# Altium schematic sheet openmv4.SchDoc
size A3; DrawnBy: 小白菜
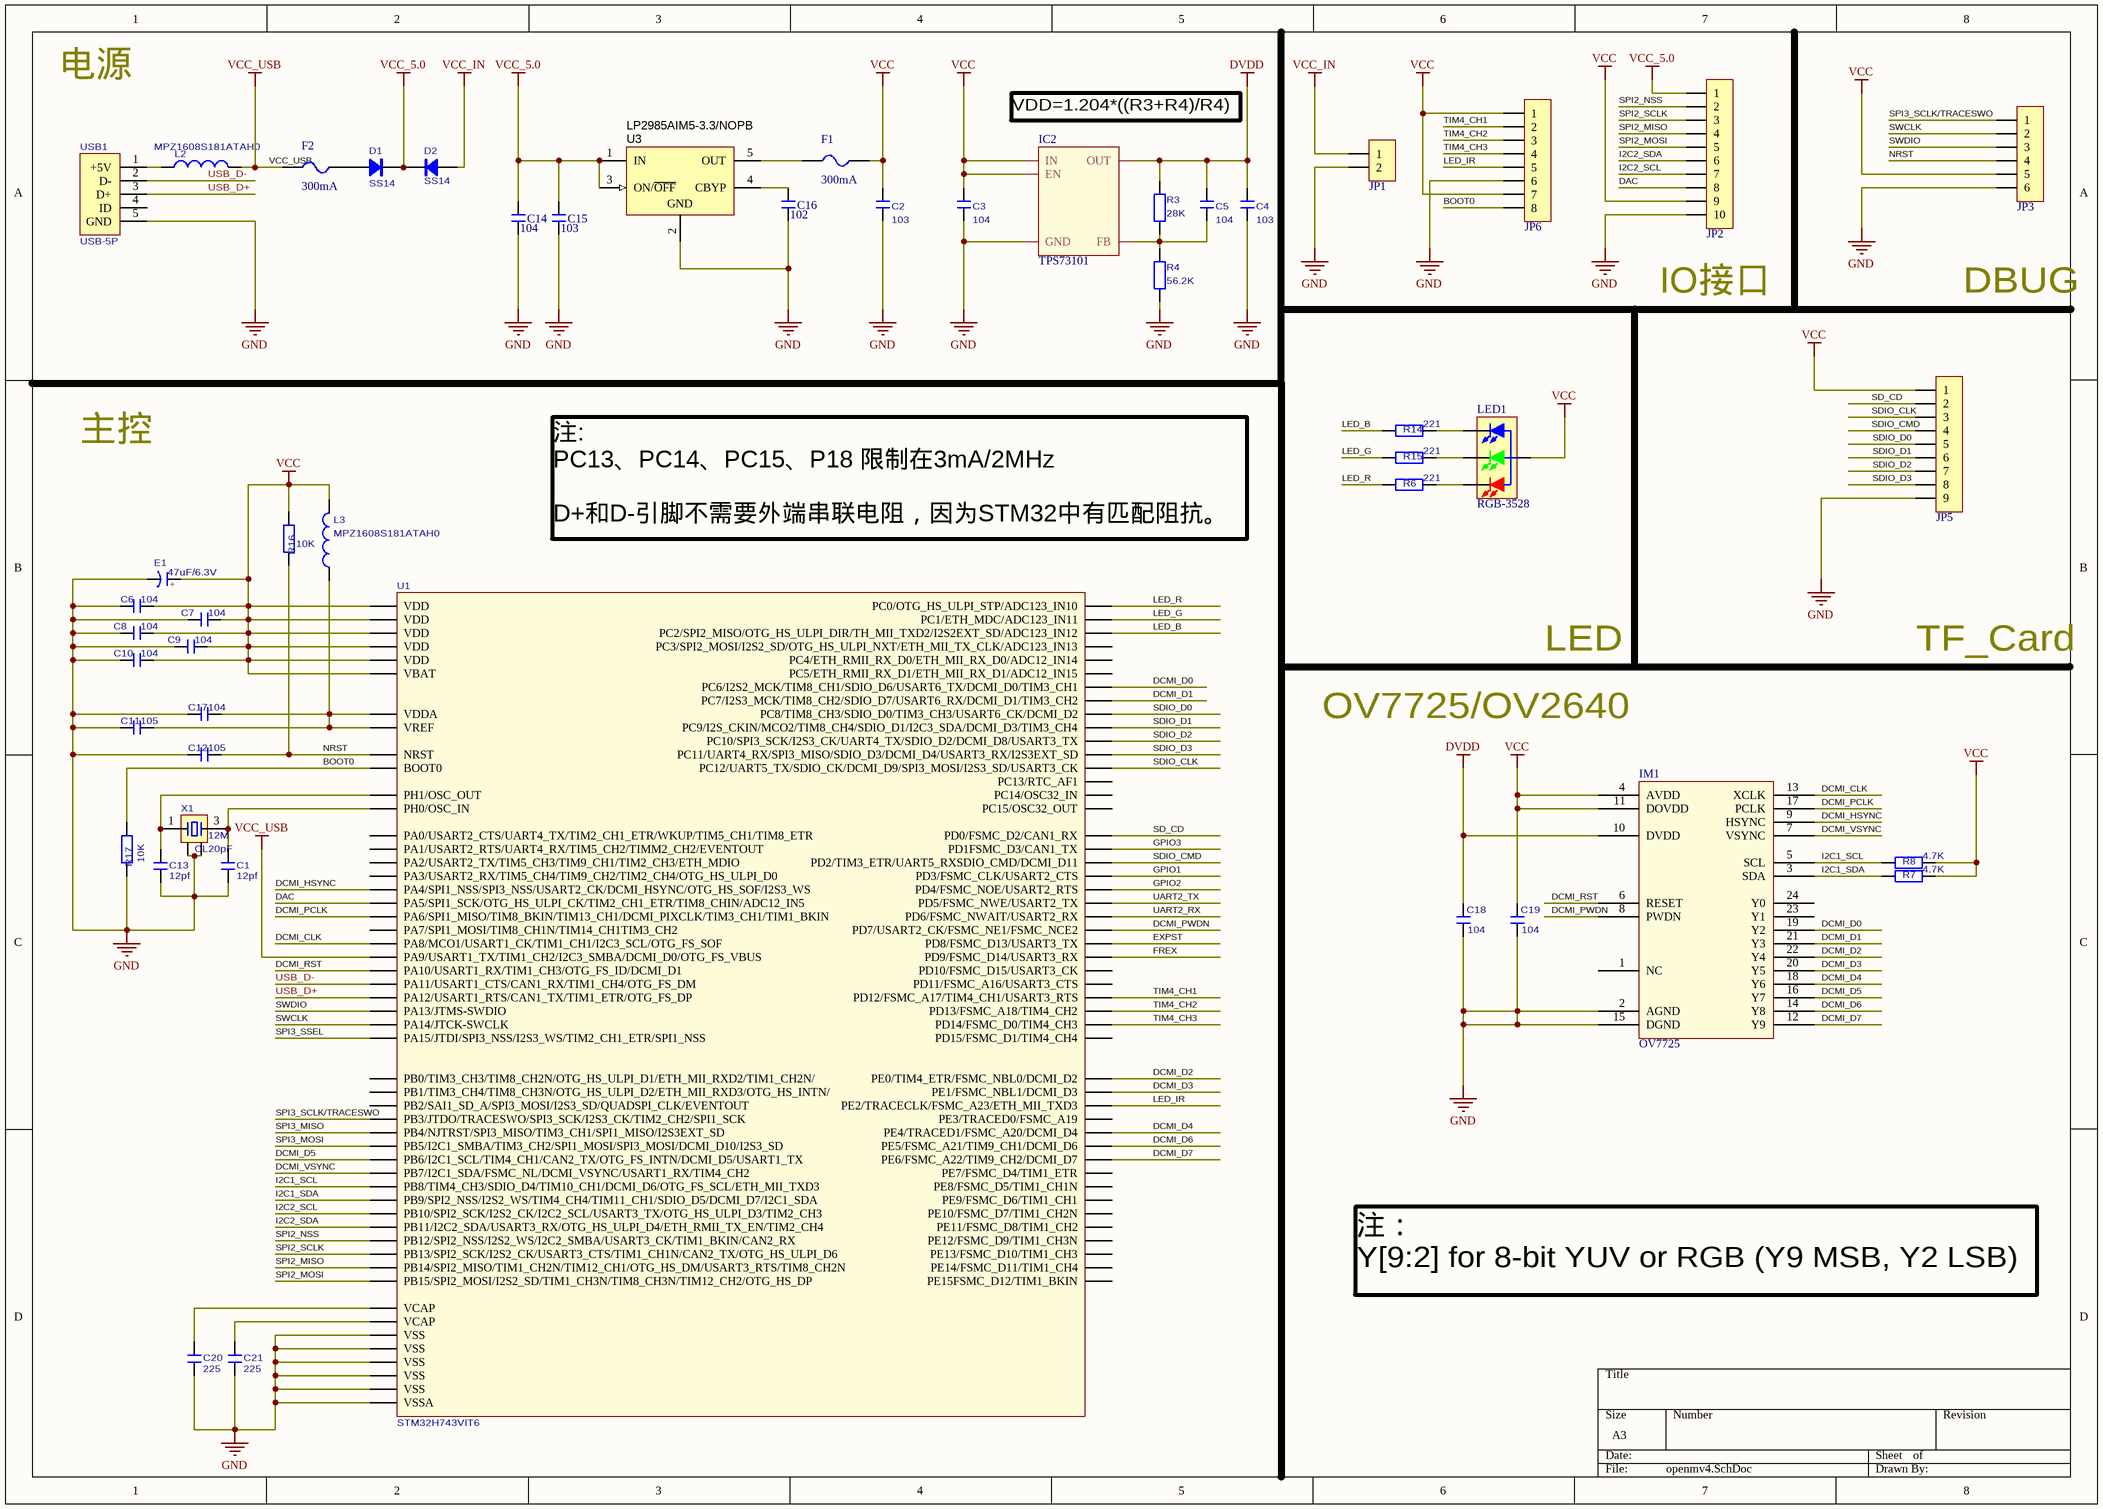
[diagram p0: openmv4.SchDoc]

## Parts
C1  12pf  [C 0603_M]
C2  103  [C 0603_M]
C3  104  [C 0603_M]
C4  103  [C 0603_M]
C5  104  [C 0603_M]
C6  104  [C 0603_M]
C7  104  [C 0603_M]
C8  104  [C 0603_M]
C9  104  [C 0603_M]
C10  104  [C 0603_M]
C11  105  [C 0603_M]
C12  105  [C 0603_M]
C13  12pf  [C 0603_M]
C14  104  [C 0603_M]
C15  103  [C 0603_M]
C16  102  [C 0603_M]
C17  104  [C 0603_M]
C18  104  [C 0603_M]
C19  104  [C 0603_M]
C20  225  [C 0603_M]
C21  225  [C 0603_M]
D1  SS14  [SOD-323]
D2  SS14  [SOD-323]
E1  47uF/6.3V  [CD A(3216)]
F1  300mA  [FU 0805]
F2  300mA  [FU 0603]
IC2  TPS73101  [SOT23-5M]
IM1  OV7725  [FPC0.5 2H-WS-24P]
JP1  HDR-1X2  [MX 1.25-WS-2P]  (value not drawn)
JP2  HDR-1X10  [MX 1.25-WS-10P]  (value not drawn)
JP3  HDR-1X6  [MX 1.25-WS-6P]  (value not drawn)
JP5  FPC1.0-9P  [FPC0.5 2H-WS-9P]  (value not drawn)
JP6  HDR-1X8  [MX 1.25-WS-8P]  (value not drawn)
L2  MPZ1608S181ATAH0  [L 0603_M]
L3  MPZ1608S181ATAH0  [L 0603_M]
LED1  RGB-3528  [LED 3528-4Pin]
R3  28K  [R 0603_M]
R4  56.2K  [R 0603_M]
R6  221  [R 0603_M]
R7  4.7K
R8  4.7K
R14  221  [R 0603_M]
R15  221  [R 0603_M]
R16  10K  [R 0603_M]
R17  10K  [R 0603_M]
U1  STM32H743VIT6  [LQFP100 14x14_M]
U3  LP2985AIM5-3.3/NOPB  [SOT23-5L]
USB1  USB-5P  [USB-MICRO_A]
X1  12M  负载电容: CL20pF  [OSC 2025-4P]

## Nets
DVDD: C4.2 C5.2 C18.2 IC2.5(OUT) IM1.10(DVDD) R3.2
GND: C1.2 C2.1 C3.1 C4.1 C6.2 C7.2 C8.2 C9.2 C10.2 C11.2 C12.2 C13.2 C14.1 C15.1 C16.1 C17.2 C18.1 C19.1 C20.2 C21.2 E1.2(K) IC2.2(GND) IM1.2(AGND) IM1.15(DGND) JP1.2 JP2.10 JP3.6 JP5.9 JP6.6 R4.1 R17.1 U1.10(VSS) U1.19(VSSA) U1.26(VSS) U1.49(VSS) U1.74(VSS) U1.99(VSS) U3.2(GND) USB1.5(GND) X1.2 X1.4
VCC: C2.2 C3.2 C6.1 C7.1 C8.1 C9.1 C10.1 C19.2 E1.1(A) F1.1 IC2.1(IN) IC2.3(EN) IM1.4(AVDD) IM1.11(DOVDD) JP2.9 JP3.5 JP5.1 JP6.1 JP6.7 L3.2 LED1.4(A) R7.1 R8.1 R16.2 U1.6(VBAT) U1.11(VDD) U1.27(VDD) U1.50(VDD) U1.75(VDD) U1.100(VDD)
VCC_5.0: C14.2 C15.2 D1.2(K) D2.2(K) JP2.1 U3.1(IN) U3.3(ON/~{OFF})
VCC_IN: D2.1(A) JP1.1
VCC_USB: F2.2 L2.2 U1.68(PA9/USART1_TX/TIM1_CH2/I2C3_SMBA/DCMI_D0/OTG_FS_VBUS)
BOOT0: JP6.8 R17.2 U1.94(BOOT0)
DAC: JP2.8 U1.29(PA5/SPI1_SCK/OTG_HS_ULPI_CK/TIM2_CH1_ETR/TIM8_CHIN/ADC12_IN5)
DCMI_CLK: IM1.13(XCLK) U1.67(PA8/MCO1/USART1_CK/TIM1_CH1/I2C3_SCL/OTG_FS_SOF)
DCMI_D0: IM1.19(Y2) U1.63(PC6/I2S2_MCK/TIM8_CH1/SDIO_D6/USART6_TX/DCMI_D0/TIM3_CH1)
DCMI_D1: IM1.21(Y3) U1.64(PC7/I2S3_MCK/TIM8_CH2/SDIO_D7/USART6_RX/DCMI_D1/TIM3_CH2)
DCMI_D2: IM1.22(Y4) U1.97(PE0/TIM4_ETR/FSMC_NBL0/DCMI_D2)
DCMI_D3: IM1.20(Y5) U1.98(PE1/FSMC_NBL1/DCMI_D3)
DCMI_D4: IM1.18(Y6) U1.3(PE4/TRACED1/FSMC_A20/DCMI_D4)
DCMI_D5: IM1.16(Y7) U1.92(PB6/I2C1_SCL/TIM4_CH1/CAN2_TX/OTG_FS_INTN/DCMI_D5/USART1_TX)
DCMI_D6: IM1.14(Y8) U1.4(PE5/FSMC_A21/TIM9_CH1/DCMI_D6)
DCMI_D7: IM1.12(Y9) U1.5(PE6/FSMC_A22/TIM9_CH2/DCMI_D7)
DCMI_HSYNC: IM1.9(HSYNC) U1.28(PA4/SPI1_NSS/SPI3_NSS/USART2_CK/DCMI_HSYNC/OTG_HS_SOF/I2S3_WS)
DCMI_PCLK: IM1.17(PCLK) U1.30(PA6/SPI1_MISO/TIM8_BKIN/TIM13_CH1/DCMI_PIXCLK/TIM3_CH1/TIM1_BKIN)
DCMI_PWDN: IM1.8(PWDN) U1.88(PD7/USART2_CK/FSMC_NE1/FSMC_NCE2)
DCMI_RST: IM1.6(RESET) U1.69(PA10/USART1_RX/TIM1_CH3/OTG_FS_ID/DCMI_D1)
DCMI_VSYNC: IM1.7(VSYNC) U1.93(PB7/I2C1_SDA/FSMC_NL/DCMI_VSYNC/USART1_RX/TIM4_CH2)
EXPST: U1.55(PD8/FSMC_D13/USART3_TX)
FREX: U1.56(PD9/FSMC_D14/USART3_RX)
GPIO1: U1.84(PD3/FSMC_CLK/USART2_CTS)
GPIO2: U1.85(PD4/FSMC_NOE/USART2_RTS)
GPIO3: U1.82(PD1FSMC_D3/CAN1_TX)
I2C1_SCL: IM1.5(SCL) R8.2 U1.95(PB8/TIM4_CH3/SDIO_D4/TIM10_CH1/DCMI_D6/OTG_FS_SCL/ETH_MII_TXD3)
I2C1_SDA: IM1.3(SDA) R7.2 U1.96(PB9/SPI2_NSS/I2S2_WS/TIM4_CH4/TIM11_CH1/SDIO_D5/DCMI_D7/I2C1_SDA)
I2C2_SCL: JP2.7 U1.46(PB10/SPI2_SCK/I2S2_CK/I2C2_SCL/USART3_TX/OTG_HS_ULPI_D3/TIM2_CH3)
I2C2_SDA: JP2.6 U1.47(PB11/I2C2_SDA/USART3_RX/OTG_HS_ULPI_D4/ETH_RMII_TX_EN/TIM2_CH4)
LED_B: R14.2 U1.17(PC2/SPI2_MISO/OTG_HS_ULPI_DIR/TH_MII_TXD2/I2S2EXT_SD/ADC123_IN12)
LED_G: R15.2 U1.16(PC1/ETH_MDC/ADC123_IN11)
LED_IR: JP6.5 U1.1(PE2/TRACECLK/FSMC_A23/ETH_MII_TXD3)
LED_R: R6.2 U1.15(PC0/OTG_HS_ULPI_STP/ADC123_IN10)
NRST: C12.1 JP3.4 R16.1 U1.14(NRST)
SD_CD: JP5.2 U1.81(PD0/FSMC_D2/CAN1_RX)
SDIO_CLK: JP5.3 U1.80(PC12/UART5_TX/SDIO_CK/DCMI_D9/SPI3_MOSI/I2S3_SD/USART3_CK)
SDIO_CMD: JP5.4 U1.83(PD2/TIM3_ETR/UART5_RXSDIO_CMD/DCMI_D11)
SDIO_D0: JP5.5 U1.65(PC8/TIM8_CH3/SDIO_D0/TIM3_CH3/USART6_CK/DCMI_D2)
SDIO_D1: JP5.6 U1.66(PC9/I2S_CKIN/MCO2/TIM8_CH4/SDIO_D1/I2C3_SDA/DCMI_D3/TIM3_CH4)
SDIO_D2: JP5.7 U1.78(PC10/SPI3_SCK/I2S3_CK/UART4_TX/SDIO_D2/DCMI_D8/USART3_TX)
SDIO_D3: JP5.8 U1.79(PC11/UART4_RX/SPI3_MISO/SDIO_D3/DCMI_D4/USART3_RX/I2S3EXT_SD)
SPI2_MISO: JP2.4 U1.53(PB14/SPI2_MISO/TIM1_CH2N/TIM12_CH1/OTG_HS_DM/USART3_RTS/TIM8_CH2N)
SPI2_MOSI: JP2.5 U1.54(PB15/SPI2_MOSI/I2S2_SD/TIM1_CH3N/TIM8_CH3N/TIM12_CH2/OTG_HS_DP)
SPI2_NSS: JP2.2 U1.51(PB12/SPI2_NSS/I2S2_WS/I2C2_SMBA/USART3_CK/TIM1_BKIN/CAN2_RX)
SPI2_SCLK: JP2.3 U1.52(PB13/SPI2_SCK/I2S2_CK/USART3_CTS/TIM1_CH1N/CAN2_TX/OTG_HS_ULPI_D6)
SPI3_MISO: U1.90(PB4/NJTRST/SPI3_MISO/TIM3_CH1/SPI1_MISO/I2S3EXT_SD)
SPI3_MOSI: U1.91(PB5/I2C1_SMBA/TIM3_CH2/SPI1_MOSI/SPI3_MOSI/DCMI_D10/I2S3_SD)
SPI3_SCLK/TRACESWO: JP3.1 U1.89(PB3/JTDO/TRACESWO/SPI3_SCK/I2S3_CK/TIM2_CH2/SPI1_SCK)
SPI3_SSEL: U1.77(PA15/JTDI/SPI3_NSS/I2S3_WS/TIM2_CH1_ETR/SPI1_NSS)
SWCLK: JP3.2 U1.76(PA14/JTCK-SWCLK)
SWDIO: JP3.3 U1.72(PA13/JTMS-SWDIO)
TIM4_CH1: JP6.2 U1.59(PD12/FSMC_A17/TIM4_CH1/USART3_RTS)
TIM4_CH2: JP6.3 U1.60(PD13/FSMC_A18/TIM4_CH2)
TIM4_CH3: JP6.4 U1.61(PD14/FSMC_D0/TIM4_CH3)
UART2_RX: U1.87(PD6/FSMC_NWAIT/USART2_RX)
UART2_TX: U1.86(PD5/FSMC_NWE/USART2_TX)
USB_D+: U1.71(PA12/USART1_RTS/CAN1_TX/TIM1_ETR/OTG_FS_DP) USB1.3(D+)
USB_D-: U1.70(PA11/USART1_CTS/CAN1_RX/TIM1_CH4/OTG_FS_DM) USB1.2(D-)
NetC1_1: C1.1 U1.12(PH0/OSC_IN) X1.3
NetC5_1: C5.1 IC2.4(FB) R3.1 R4.2
NetC11_1: C11.1 C17.1 L3.1 U1.20(VREF) U1.21(VDDA)
NetC13_1: C13.1 U1.13(PH1/OSC_OUT) X1.1
NetC16_2: C16.2 U3.4(CBYP)
NetC20_1: C20.1 U1.48(VCAP)
NetC21_1: C21.1 U1.73(VCAP)
NetD1_1: D1.1(A) F2.1
NetF1_2: F1.2 U3.5(OUT)
NetL2_1: L2.1 USB1.1(+5V)
NetLED1_1: LED1.1(RED_K) R6.1
NetLED1_2: LED1.2(GREEN_K) R15.1
NetLED1_3: LED1.3(BULE_K) R14.1

Not connected (* = marked no-connect by the designer): IM1 1(NC) 23(Y1) 24(Y0); U1 2(PE3/TRACED0/FSMC_A19) 7(PC13/RTC_AF1) 8(PC14/OSC32_IN) 9(PC15/OSC32_OUT) 18(PC3/SPI2_MOSI/I2S2_SD/OTG_HS_ULPI_NXT/ETH_MII_TX_CLK/ADC123_IN13) 22(PA0/USART2_CTS/UART4_TX/TIM2_CH1_ETR/WKUP/TIM5_CH1/TIM8_ETR) 23(PA1/USART2_RTS/UART4_RX/TIM5_CH2/TIMM2_CH2/EVENTOUT) 24(PA2/USART2_TX/TIM5_CH3/TIM9_CH1/TIM2_CH3/ETH_MDIO) 25(PA3/USART2_RX/TIM5_CH4/TIM9_CH2/TIM2_CH4/OTG_HS_ULPI_D0) 31(PA7/SPI1_MOSI/TIM8_CH1N/TIM14_CH1TIM3_CH2) 32(PC4/ETH_RMII_RX_D0/ETH_MII_RX_D0/ADC12_IN14) 33(PC5/ETH_RMII_RX_D1/ETH_MII_RX_D1/ADC12_IN15) 34(PB0/TIM3_CH3/TIM8_CH2N/OTG_HS_ULPI_D1/ETH_MII_RXD2/TIM1_CH2N/) 35(PB1/TIM3_CH4/TIM8_CH3N/OTG_HS_ULPI_D2/ETH_MII_RXD3/OTG_HS_INTN/) 36(PB2/SAI1_SD_A/SPI3_MOSI/I2S3_SD/QUADSPI_CLK/EVENTOUT) 37(PE7/FSMC_D4/TIM1_ETR) 38(PE8/FSMC_D5/TIM1_CH1N) 39(PE9/FSMC_D6/TIM1_CH1) 40(PE10/FSMC_D7/TIM1_CH2N) 41(PE11/FSMC_D8/TIM1_CH2) 42(PE12/FSMC_D9/TIM1_CH3N) 43(PE13/FSMC_D10/TIM1_CH3) 44(PE14/FSMC_D11/TIM1_CH4) 45(PE15FSMC_D12/TIM1_BKIN) 57(PD10/FSMC_D15/USART3_CK) 58(PD11/FSMC_A16/USART3_CTS) 62(PD15/FSMC_D1/TIM4_CH4); USB1 4(ID)

## Notes on the sheet
- 电源
- (near IC2) VDD=1.204*((R3+R4)/R4)
- (near JP2) IO接口
- DBUG
- 主控
- 注:
  PC13、PC14、PC15、P18 限制在3mA/2MHz
  D+和D-引脚不需要外端串联电阻，因为STM32中有匹配阻抗。
- OV7725/OV2640
- LED
- TF_Card
- 注：
  Y[9:2] for 8-bit YUV or RGB (Y9 MSB, Y2 LSB)
- (in symbol C-CD) +

## Library data of the parts
C1-C13 C17-C21 = C: 无极性贴片电容; 版权归属: 源创客; 材质: X7R; BOM名称: 无极性贴片电容; 学习资源: www.ooocke.com
C14-C16 = C: 无极性贴片电容; 版权归属: 源创客; BOM名称: 无极性贴片电容; 学习资源: www.ooocke.com
D1 D2 = SS14: 肖特基二极管; 版权归属: 源创客; 属性: 40V/1A; BOM名称: 肖特基二极管; 学习资源: www.ooocke.com
E1 = C-CD: 贴片钽电容; 版权归属: 源创客; BOM名称: 贴片钽电容; 学习资源: www.ooocke.com
F1 F2 = FU: 贴片保险丝; 版权归属: 源创客; BOM名称: 贴片保险丝; 学习资源: www.ooocke.com
IC2 = TPS731
IM1 = OV7725_Down: pin to pad: 1>24 2>23 3>22 4>21 5>20 6>19 7>18 8>17 9>16 10>15 11>14 12>13 13>12 14>11 15>10 16>9 17>8 18>7 19>6 20>5 21>4 22>3 23>2 24>1
JP1 = Header 2: 2P接插件; 版权归属: 源创客; BOM名称: 2P接插件; 学习资源: www.ooocke.com
JP2 = Header 10: 10P接插件; 版权归属: 源创客; BOM名称: 10P接插件; 学习资源: www.ooocke.com
JP3 = Header 6: 6P接插件; 版权归属: 源创客; BOM名称: 6P接插件; 学习资源: www.ooocke.com
JP5 = FPC-9P: FPC连接器; 版权归属: 源创客; BOM名称: FPC连接器; 学习资源: www.ooocke.com
JP6 = Header 8: 8P接插件; 版权归属: 源创客; BOM名称: 8P接插件; 学习资源: www.ooocke.com
L2 L3 = L: 小功率贴片电感; 版权归属: 源创客; BOM名称: 小功率贴片电感; 学习资源: www.ooocke.com
LED1 = LED-RGB-3528: 三基色LED; 版权归属: 源创客; BOM名称: 三基色LED; 学习资源: www.ooocke.com
R3 R4 R6-R8 R14-R17 = R: 贴片电阻; 版权归属: 源创客; BOM名称: 贴片电阻; 学习资源: www.ooocke.com
U3 = LP2985AIM5-3.3/NOPB: Micropower 150 mA Low-Noise Ultra Low-Dropout Regulator, 5-pin SOT-23, Pb-Free; Manufacturer: Texas Instruments; PackageTopMarking: L0RA*XTT; PowerWise: N; CompType: LDO IC; Published: 1-Mar-2010; DatasheetVersion: Jul-2007; PackageVersion: revD, Aug-2008; PackageReference: MF05A; Publisher: Altium Limited; PackageDescription: Molded SOT-23, .115 x .063 x .040 in Body, 5 Lead, .0375 in Pitch; Supplier 1: Digi-Key; Supplier Part Number 1: LP2985AIM5-3.3CT-ND; Supplier 2: Digi-Key; Supplier Part Number 2: LP2985AIM5-3.3TR-ND; Supplier 3: Digi-Key; Supplier Part Number 3: LP2985AIM5-3.3DKR-ND; Supplier 4: Farnell; Supplier Part Number 4: 1469134; PartNumber: LP2985AIM5-3.3/NOPB; RoHS: Y; PinCount: 5; ComponentLink1Description: LP2985 Datasheet; ComponentLink1URL: http://www.national.com/ds/LP/LP2985.pdf; ComponentLink2Description: LP2985 Web Page; ComponentLink2URL: http://www.national.com/pf/LP/LP2985.html; ComponentLink3Description: MF05A Package Page; ComponentLink3URL: http://www.national.com/packaging/folders/mf05a.html
USB1 = USB-5P: 微型USB母座; 版权归属: 源创客; BOM名称: 微型USB母座; 学习资源: www.ooocke.com
X1 = XTAL-4P: 4脚无源晶振; 版权归属: 源创客; BOM名称: 4脚无源晶振; 学习资源: www.ooocke.com